# EAGLE schematic touch_glove (EAGLE 9.3.1)
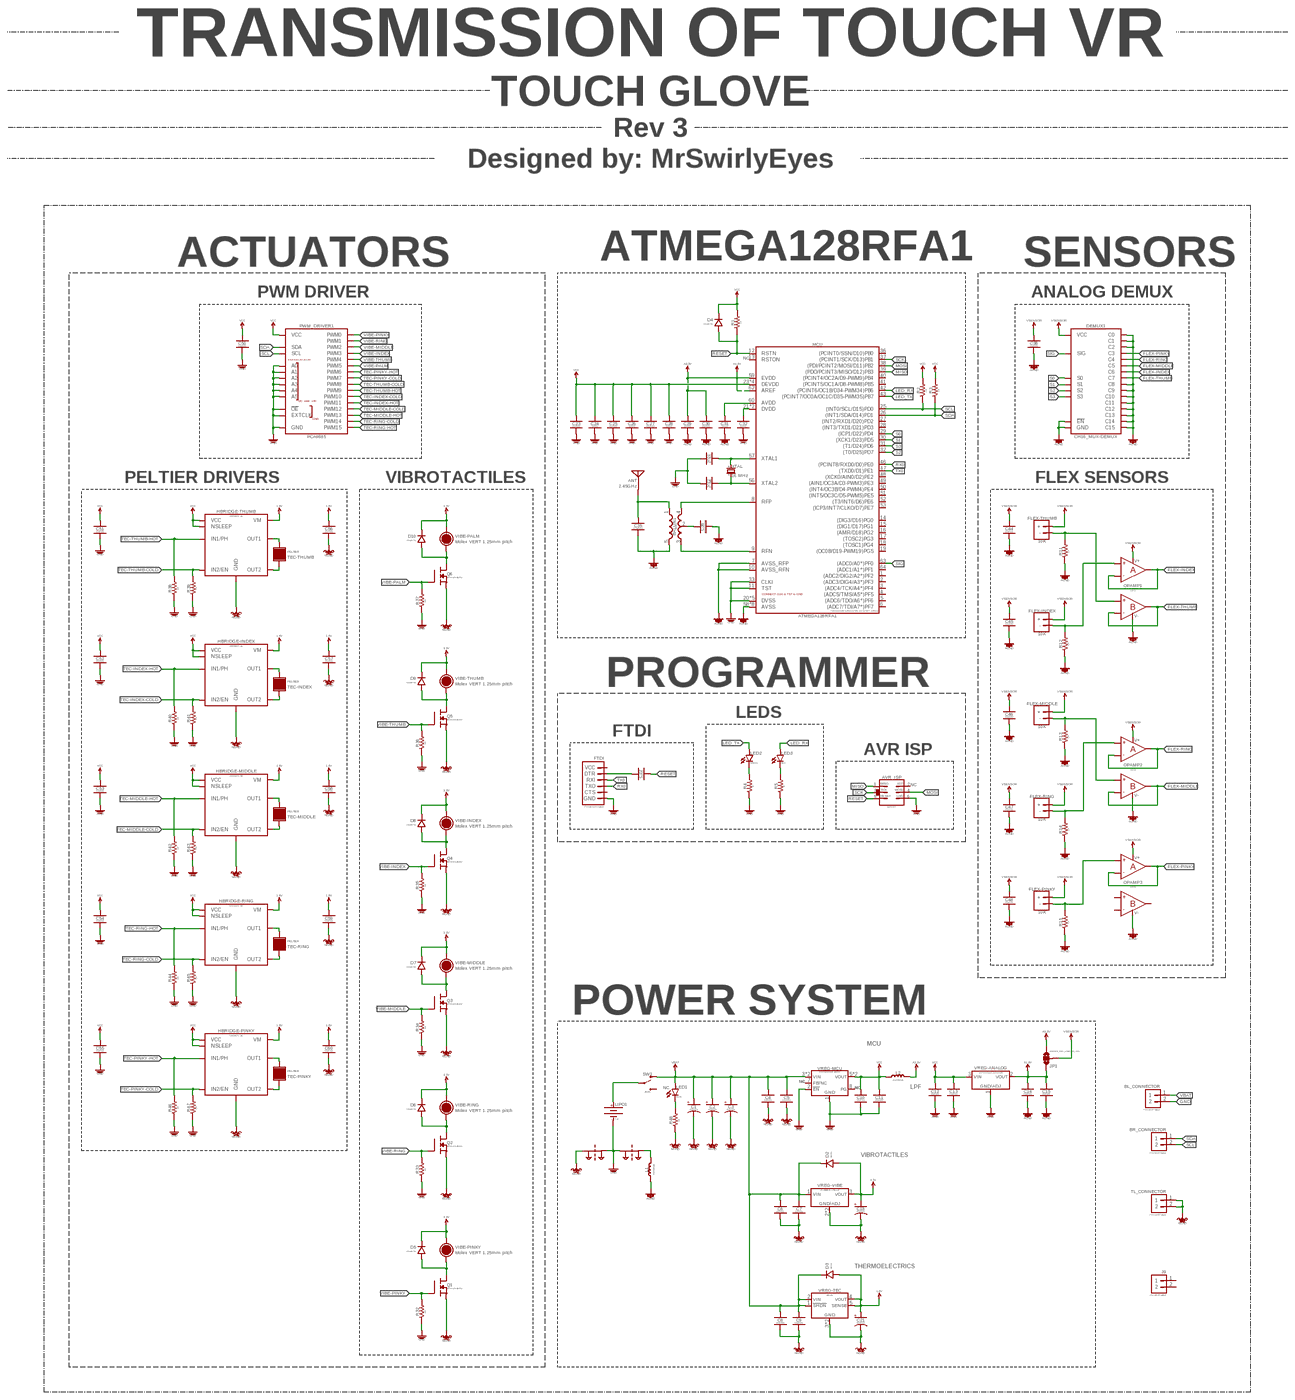
[diagram p0: schematic, sheet 1, overview]
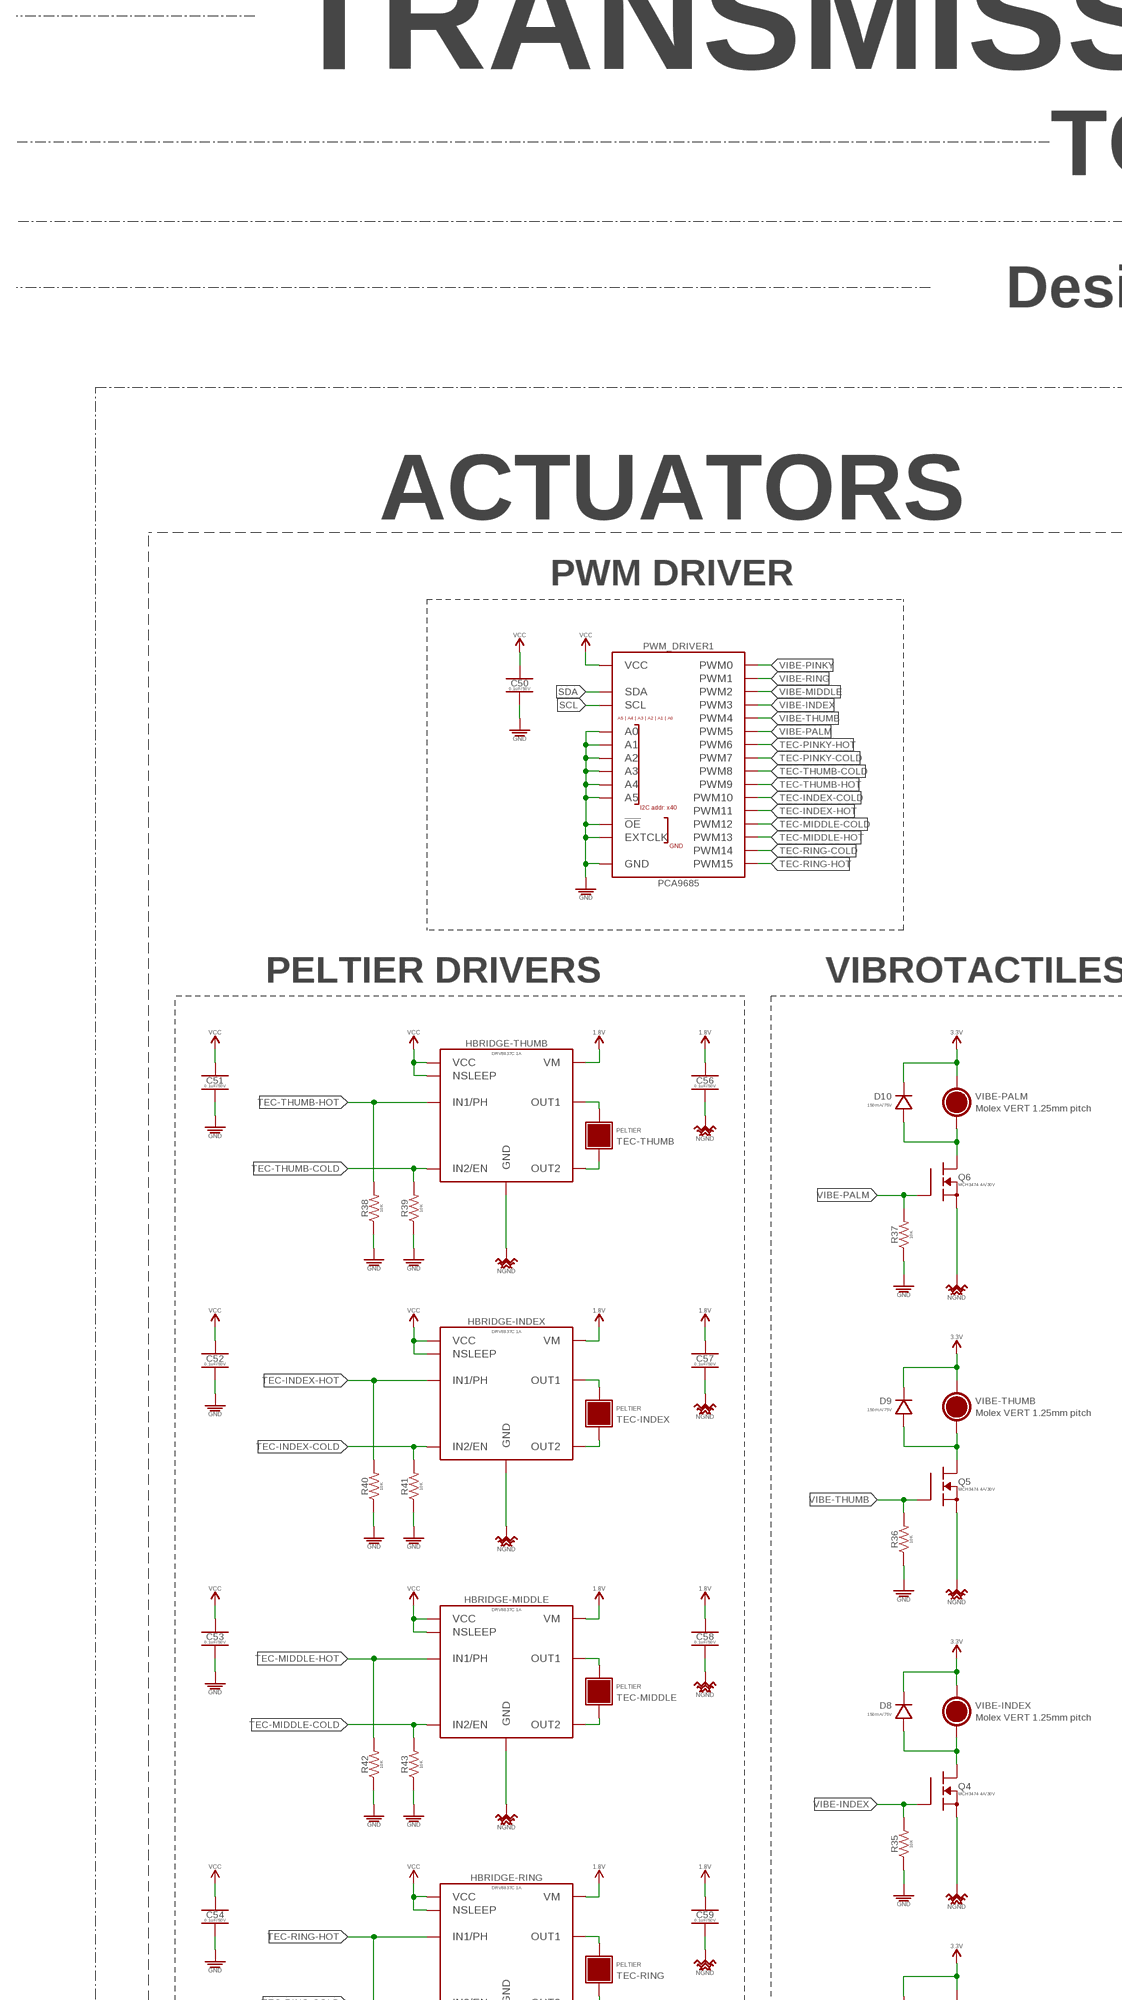
[diagram p1: schematic, sheet 1, part 1 of 4]
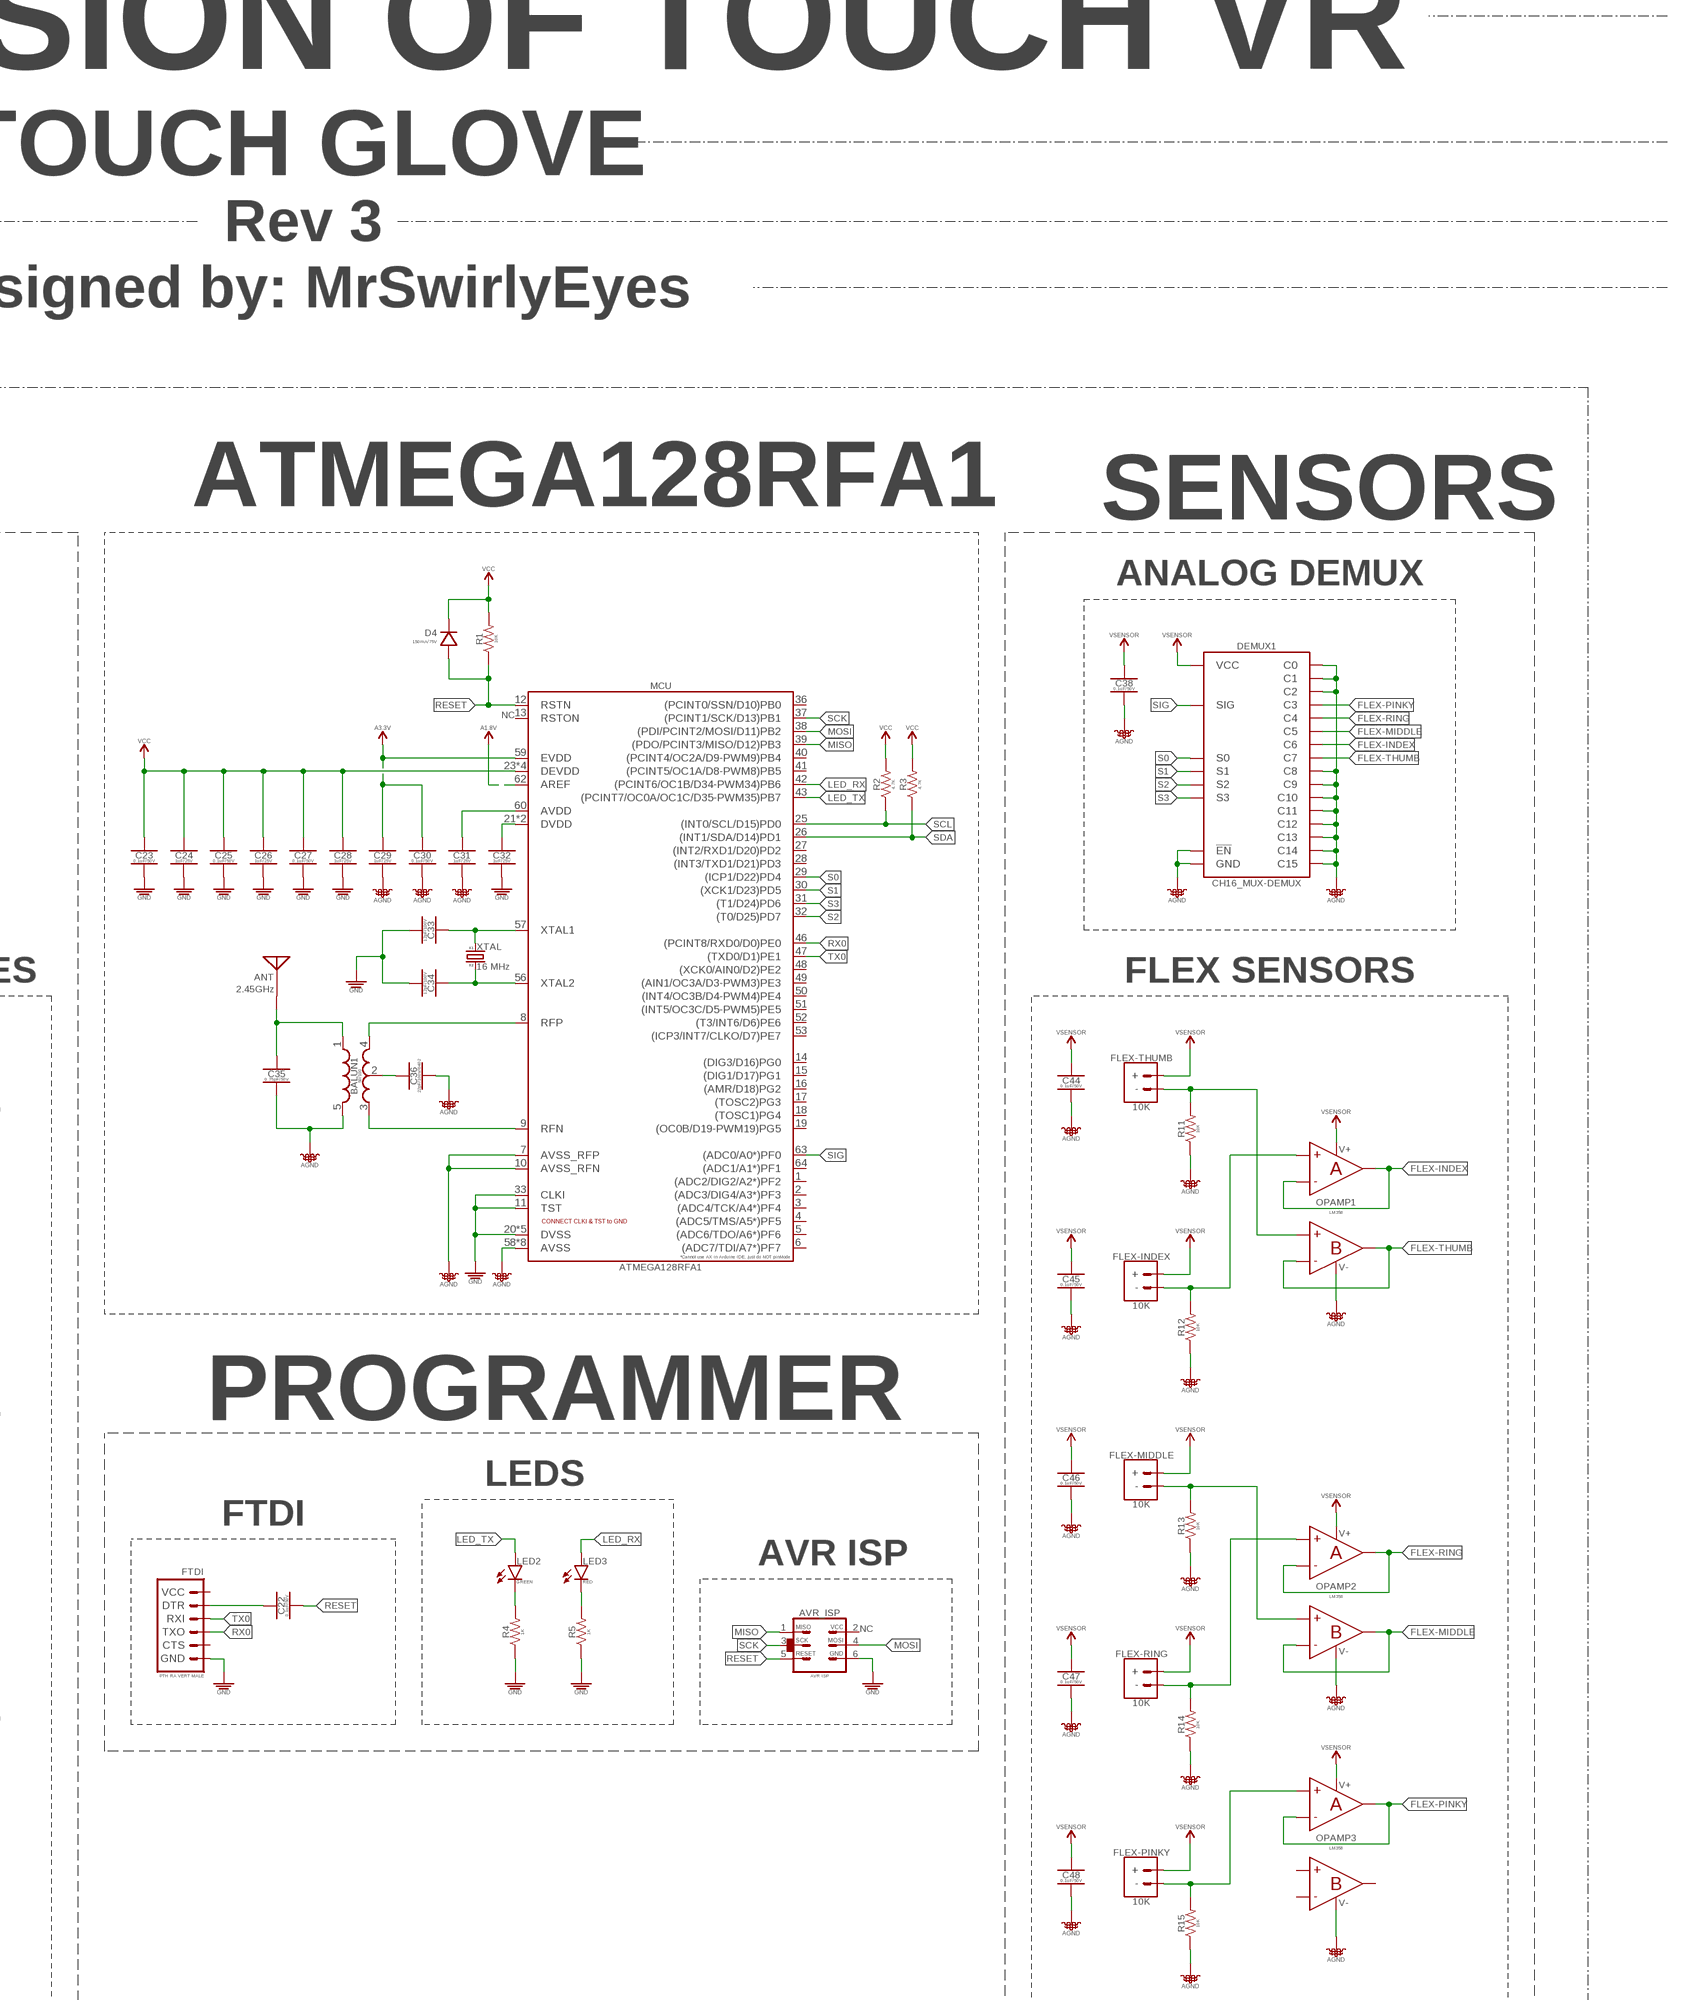
[diagram p2: schematic, sheet 1, part 2 of 4]
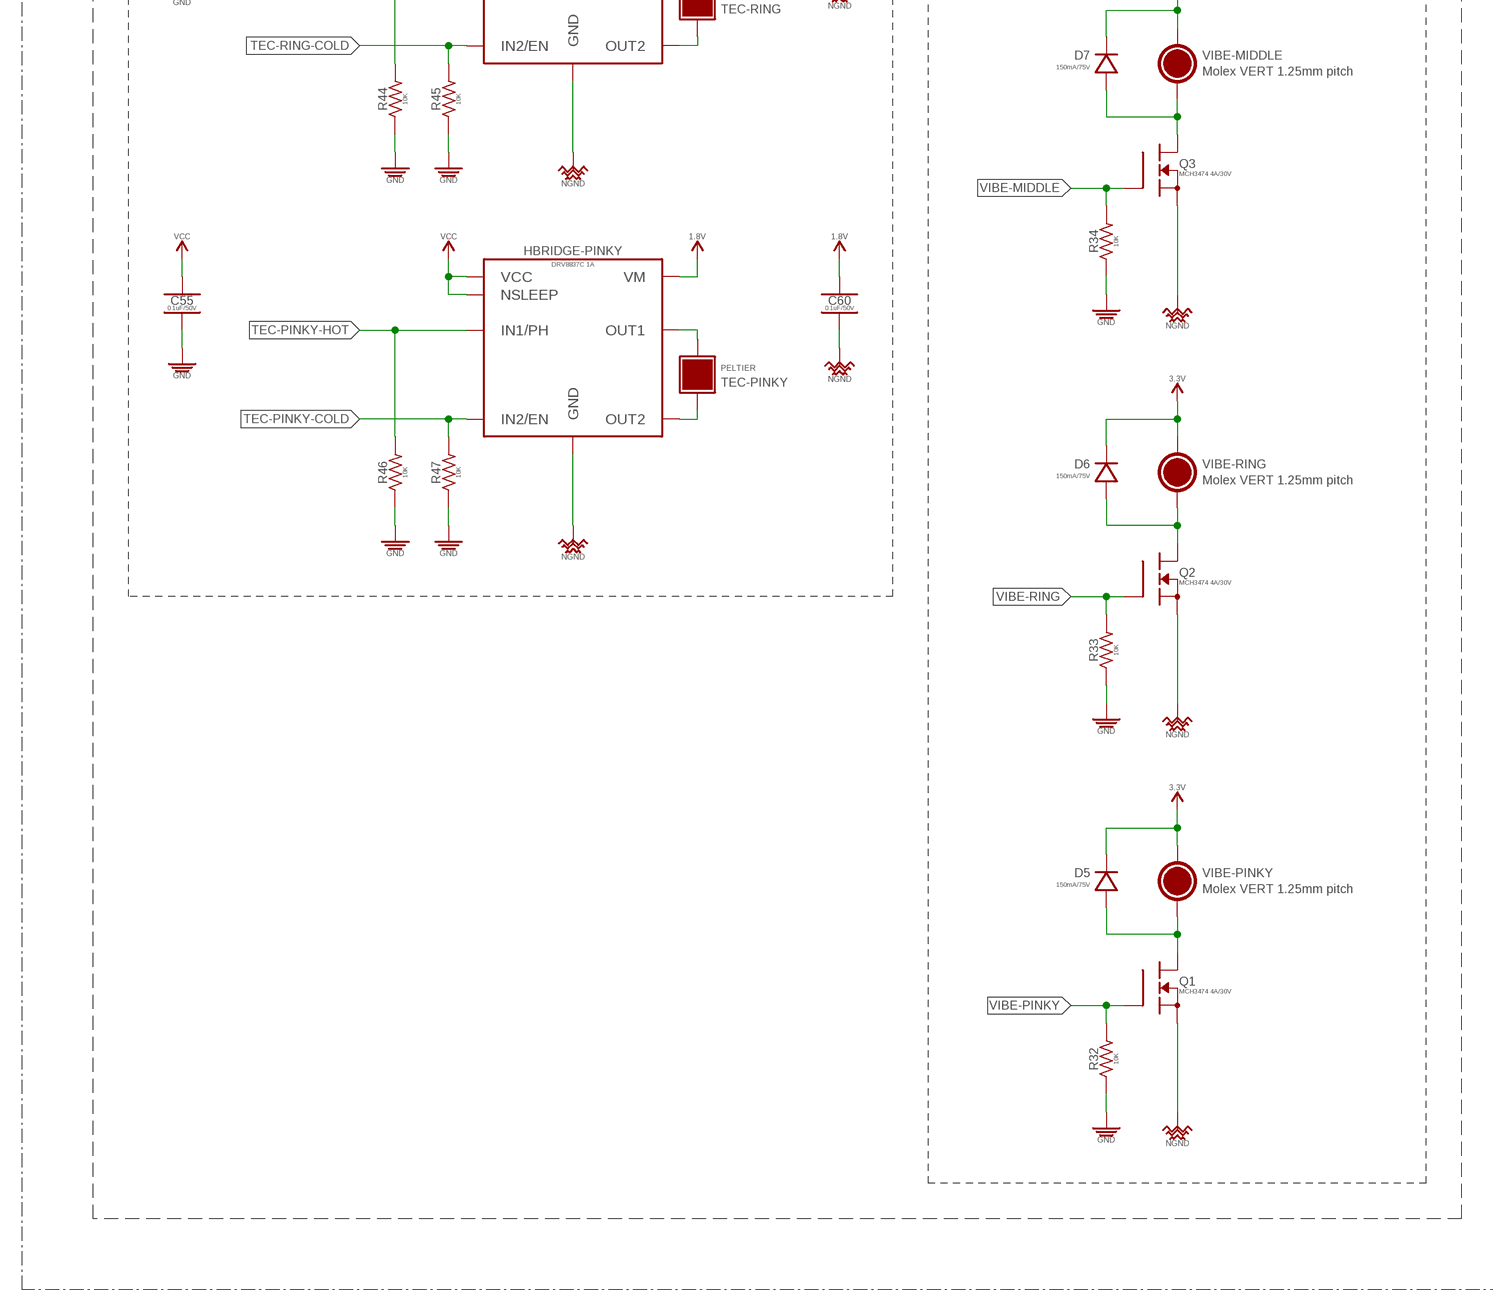
[diagram p3: schematic, sheet 1, part 3 of 4]
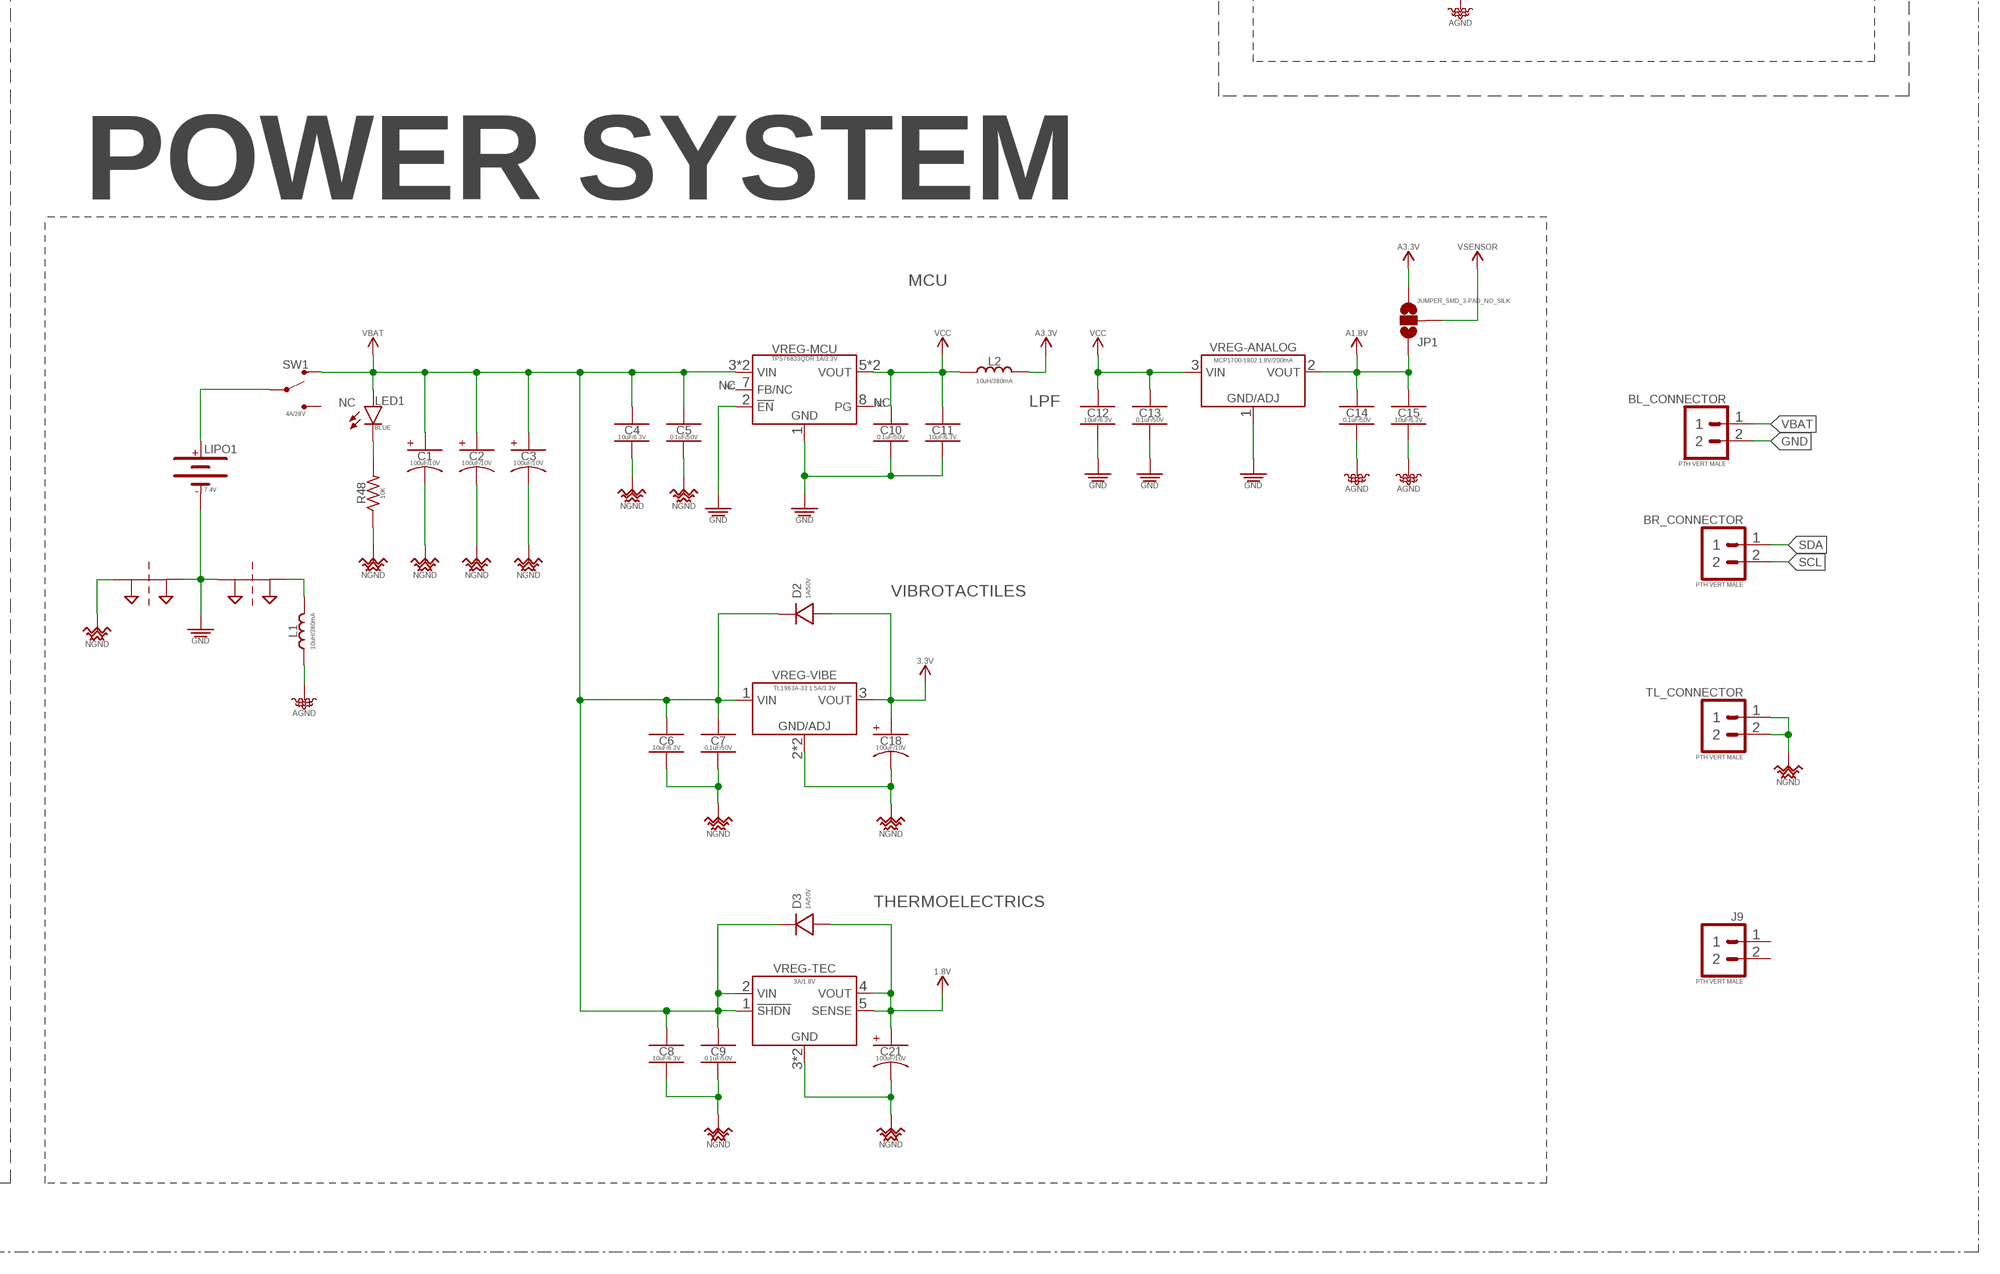
[diagram p4: schematic, sheet 1, part 4 of 4]

## Parts
ANT  2.45GHz  ANTENNA_SMD_CHP-2.45GHZ-0.5DBI-3W  [ANTC6522X100]
AVR_ISP  AVR ISP  AVR_SPI_PRG_6_PTH_VERT_MALE_2.54MM  [HDRV6W64P254_2X3_762X508X838B]
BALUN1  50/100  BALUN_SMD-0805_UNBAL/BAL-50/100  [RESCAXE65P200X125X95-6]
BL_CONNECTOR  PTH VERT MALE  1X02_PTH_VERT_MALE_2.54MM  [HDRV2W64P254_1X2_508X254X838B]
BR_ANALOG  NET_BRIDGE  [NET_BRIDGE]
BR_CONNECTOR  PTH VERT MALE  1X02_PTH_VERT_MALE_2.54MM  [HDRV2W64P254_1X2_508X254X838B]
BR_NOISE  NET_BRIDGE  [NET_BRIDGE]
C1  100uF/10V  100UF-POLARIZED_TANT_SMD-1206_10V-20%  [CAPCP3216X160]
C2  100uF/10V  100UF-POLARIZED_TANT_SMD-1206_10V-20%  [CAPCP3216X160]
C3  100uF/10V  100UF-POLARIZED_TANT_SMD-1206_10V-20%  [CAPCP3216X160]
C4  10uF/6.3V  10UF_CER_SMD-0402_6.3V-20%  [CAPC1005X55_SMD-0402]
C5  0.1uF/50V  0.1UF_SMD-0402_50V-10%  [CAPC1005X55_SMD-0402]
C6  10uF/6.3V  10UF_CER_SMD-0402_6.3V-20%  [CAPC1005X55_SMD-0402]
C7  0.1uF/50V  0.1UF_SMD-0402_50V-10%  [CAPC1005X55_SMD-0402]
C8  10uF/6.3V  10UF_CER_SMD-0402_6.3V-20%  [CAPC1005X55_SMD-0402]
C9  0.1uF/50V  0.1UF_SMD-0402_50V-10%  [CAPC1005X55_SMD-0402]
C10  0.1uF/50V  0.1UF_SMD-0402_50V-10%  [CAPC1005X55_SMD-0402]
C11  10uF/6.3V  10UF_CER_SMD-0402_6.3V-20%  [CAPC1005X55_SMD-0402]
C12  10uF/6.3V  10UF_CER_SMD-0402_6.3V-20%  [CAPC1005X55_SMD-0402]
C13  0.1uF/50V  0.1UF_SMD-0402_50V-10%  [CAPC1005X55_SMD-0402]
C14  0.1uF/50V  0.1UF_SMD-0402_50V-10%  [CAPC1005X55_SMD-0402]
C15  10uF/6.3V  10UF_CER_SMD-0402_6.3V-20%  [CAPC1005X55_SMD-0402]
C18  100uF/10V  100UF-POLARIZED_TANT_SMD-1206_10V-20%  [CAPCP3216X160]
C21  100uF/10V  100UF-POLARIZED_TANT_SMD-1206_10V-20%  [CAPCP3216X160]
C22  0.1uF/50V  0.1UF_SMD-0402_50V-10%  [CAPC1005X55_SMD-0402]
C23  0.1uF/50V  0.1UF_SMD-0402_50V-10%  [CAPC1005X55_SMD-0402]
C24  1uF/25V  1UF_CER_SMD-0402_25V-10%  [CAPC1005X55_SMD-0402]
C25  0.1uF/50V  0.1UF_SMD-0402_50V-10%  [CAPC1005X55_SMD-0402]
C26  1uF/25V  1UF_CER_SMD-0402_25V-10%  [CAPC1005X55_SMD-0402]
C27  0.1uF/50V  0.1UF_SMD-0402_50V-10%  [CAPC1005X55_SMD-0402]
C28  1uF/25V  1UF_CER_SMD-0402_25V-10%  [CAPC1005X55_SMD-0402]
C29  1uF/25V  1UF_CER_SMD-0402_25V-10%  [CAPC1005X55_SMD-0402]
C30  0.1uF/50V  0.1UF_SMD-0402_50V-10%  [CAPC1005X55_SMD-0402]
C31  1uF/25V  1UF_CER_SMD-0402_25V-10%  [CAPC1005X55_SMD-0402]
C32  1uF/25V  1UF_CER_SMD-0402_25V-10%  [CAPC1005X55_SMD-0402]
C33  12pF/100V  12PF_SMD-0402_100V-5%  [CAPC1005X55_SMD-0402]
C34  12pF/100V  12PF_SMD-0402_100V-5%  [CAPC1005X55_SMD-0402]
C35  0.75pF/50V  0.75PF_CER_SMD-0402_50V-33%  [CAPC1005X55_SMD-0402]
C36  22pF/100V/0402  22PF_CER_SMD-0402-100V-5%  [CAPC1005X55_SMD-0402]
C38  0.1uF/50V  0.1UF_SMD-0402_50V-10%  [CAPC1005X55_SMD-0402]
C44  0.1uF/50V  0.1UF_SMD-0402_50V-10%  [CAPC1005X55_SMD-0402]
C45  0.1uF/50V  0.1UF_SMD-0402_50V-10%  [CAPC1005X55_SMD-0402]
C46  0.1uF/50V  0.1UF_SMD-0402_50V-10%  [CAPC1005X55_SMD-0402]
C47  0.1uF/50V  0.1UF_SMD-0402_50V-10%  [CAPC1005X55_SMD-0402]
C48  0.1uF/50V  0.1UF_SMD-0402_50V-10%  [CAPC1005X55_SMD-0402]
C50  0.1uF/50V  0.1UF_SMD-0402_50V-10%  [CAPC1005X55_SMD-0402]
C51  0.1uF/50V  0.1UF_SMD-0402_50V-10%  [CAPC1005X55_SMD-0402]
C52  0.1uF/50V  0.1UF_SMD-0402_50V-10%  [CAPC1005X55_SMD-0402]
C53  0.1uF/50V  0.1UF_SMD-0402_50V-10%  [CAPC1005X55_SMD-0402]
C54  0.1uF/50V  0.1UF_SMD-0402_50V-10%  [CAPC1005X55_SMD-0402]
C55  0.1uF/50V  0.1UF_SMD-0402_50V-10%  [CAPC1005X55_SMD-0402]
C56  0.1uF/50V  0.1UF_SMD-0402_50V-10%  [CAPC1005X55_SMD-0402]
C57  0.1uF/50V  0.1UF_SMD-0402_50V-10%  [CAPC1005X55_SMD-0402]
C58  0.1uF/50V  0.1UF_SMD-0402_50V-10%  [CAPC1005X55_SMD-0402]
C59  0.1uF/50V  0.1UF_SMD-0402_50V-10%  [CAPC1005X55_SMD-0402]
C60  0.1uF/50V  0.1UF_SMD-0402_50V-10%  [CAPC1005X55_SMD-0402]
D2  1A/50V  GENERAL-PURPOSE_SMD_GP_1A-50V  [SODFL3516X170]
D3  1A/50V  GENERAL-PURPOSE_SMD_GP_1A-50V  [SODFL3516X170]
D4  150mA/75V  GENERAL-PURPOSE_SMD-0402_GP_150MA-75V  [DFN100X60X55-2]
D5  150mA/75V  GENERAL-PURPOSE_SMD-0402_GP_150MA-75V  [DFN100X60X55-2]
D6  150mA/75V  GENERAL-PURPOSE_SMD-0402_GP_150MA-75V  [DFN100X60X55-2]
D7  150mA/75V  GENERAL-PURPOSE_SMD-0402_GP_150MA-75V  [DFN100X60X55-2]
D8  150mA/75V  GENERAL-PURPOSE_SMD-0402_GP_150MA-75V  [DFN100X60X55-2]
D9  150mA/75V  GENERAL-PURPOSE_SMD-0402_GP_150MA-75V  [DFN100X60X55-2]
D10  150mA/75V  GENERAL-PURPOSE_SMD-0402_GP_150MA-75V  [DFN100X60X55-2]
DEMUX1  CH16_MUX-DEMUX  CD74HC4067-SM96_16:1_MUX-DEMUX_SOP-24_16:1-MUX-DEMUX  [SOP65P780X200-24]
FLEX-INDEX  10K  FLEX_SENSOR_0530470210_VERT-MALE_PITCH-1.25MM  [_MOLEX-0530470210_VERT_PITCH-1.25MM]
FLEX-MIDDLE  10K  FLEX_SENSOR_0530470210_VERT-MALE_PITCH-1.25MM  [_MOLEX-0530470210_VERT_PITCH-1.25MM]
FLEX-PINKY  10K  FLEX_SENSOR_0530470210_VERT-MALE_PITCH-1.25MM  [_MOLEX-0530470210_VERT_PITCH-1.25MM]
FLEX-RING  10K  FLEX_SENSOR_0530470210_VERT-MALE_PITCH-1.25MM  [_MOLEX-0530470210_VERT_PITCH-1.25MM]
FLEX-THUMB  10K  FLEX_SENSOR_0530470210_VERT-MALE_PITCH-1.25MM  [_MOLEX-0530470210_VERT_PITCH-1.25MM]
FTDI  PTH RA VERT MALE  FTDI_PTH_RA_MALE_2.54MM  [HDRRA6W64P254_1X6_1524X254X254B_FTDI]
HBRIDGE-INDEX  DRV8837C 1A  DRV883X_H-BRIDGE_DRV8837C_1A  [WSON-8-PPAD]
HBRIDGE-MIDDLE  DRV8837C 1A  DRV883X_H-BRIDGE_DRV8837C_1A  [WSON-8-PPAD]
HBRIDGE-PINKY  DRV8837C 1A  DRV883X_H-BRIDGE_DRV8837C_1A  [WSON-8-PPAD]
HBRIDGE-RING  DRV8837C 1A  DRV883X_H-BRIDGE_DRV8837C_1A  [WSON-8-PPAD]
HBRIDGE-THUMB  DRV8837C 1A  DRV883X_H-BRIDGE_DRV8837C_1A  [WSON-8-PPAD]
J9  PTH VERT MALE  1X02_PTH_VERT_MALE_2.54MM  [HDRV2W64P254_1X2_508X254X838B]
JP1  JUMPER_SMD_3-PAD_NO_SILK  [SMT-JUMPER_3_NO_SILK]
L1  10uH/380mA  10UH_SMD-0603_0.38A-0.468OHM-10%  [INDC1608X60-0603]
L2  10uH/380mA  10UH_SMD-0603_0.38A-0.468OHM-10%  [INDC1608X60-0603]
LED1  BLUE  LED_SMD-0402_DISCRETE_BLUE  [LEDC1005X40_LED-0402]
LED2  GREEN  LED_SMD-0402_DISCRETE_GREEN  [LEDC1005X40_LED-0402]
LED3  RED  LED_SMD-0402_DISCRETE_RED  [LEDC1005X40_LED-0402]
LIPO1  7.4V  BATTERY-CONNECTOR_MOLEX_0530470210_VERT-MALE_PITCH-1.25MM  [BATTERY_MOLEX-0530470210_VERT_PITCH-1.25MM]
MCU  ATMEGA128RFA1  ATMEGA128RFA1_VFQFN-64_EXPOSED-PAD  [QFN50P900X900X90-64]
OPAMP1  LM358  LM358_DFN-EP  [WSON-8-PPAD]
OPAMP2  LM358  LM358_DFN-EP  [WSON-8-PPAD]
OPAMP3  LM358  LM358_DFN-EP  [WSON-8-PPAD]
PWM_DRIVER1  PCA9685  PCA9685_16-CH_12-BIT_PWM-DRIVER_TSSOP-28_PWM-DRIVER_16CH  [SOP65P650X110-28]
Q1  MCH3474 4A/30V  POWER_NCHAN_MCH3474_NMOS_4A-30V  [SOTFL65P209X90-3]
Q2  MCH3474 4A/30V  POWER_NCHAN_MCH3474_NMOS_4A-30V  [SOTFL65P209X90-3]
Q3  MCH3474 4A/30V  POWER_NCHAN_MCH3474_NMOS_4A-30V  [SOTFL65P209X90-3]
Q4  MCH3474 4A/30V  POWER_NCHAN_MCH3474_NMOS_4A-30V  [SOTFL65P209X90-3]
Q5  MCH3474 4A/30V  POWER_NCHAN_MCH3474_NMOS_4A-30V  [SOTFL65P209X90-3]
Q6  MCH3474 4A/30V  POWER_NCHAN_MCH3474_NMOS_4A-30V  [SOTFL65P209X90-3]
R1  10K  10KΩ_SMD-0402_1/16W-5%  [RESC1005X35_SMD-0402]
R2  4.7K  4.7KΩ_SMD-0402_1/16W-5%  [RESC1005X35_SMD-0402]
R3  4.7K  4.7KΩ_SMD-0402_1/16W-5%  [RESC1005X35_SMD-0402]
R4  1K  1KΩ_SMD-0402_1/16W-5%  [RESC1005X35_SMD-0402]
R5  1K  1KΩ_SMD-0402_1/16W-5%  [RESC1005X35_SMD-0402]
R11  10K  10KΩ_SMD-0402_1/16W-5%  [RESC1005X35_SMD-0402]
R12  10K  10KΩ_SMD-0402_1/16W-5%  [RESC1005X35_SMD-0402]
R13  10K  10KΩ_SMD-0402_1/16W-5%  [RESC1005X35_SMD-0402]
R14  10K  10KΩ_SMD-0402_1/16W-5%  [RESC1005X35_SMD-0402]
R15  10K  10KΩ_SMD-0402_1/16W-5%  [RESC1005X35_SMD-0402]
R32  10K  10KΩ_SMD-0402_1/16W-5%  [RESC1005X35_SMD-0402]
R33  10K  10KΩ_SMD-0402_1/16W-5%  [RESC1005X35_SMD-0402]
R34  10K  10KΩ_SMD-0402_1/16W-5%  [RESC1005X35_SMD-0402]
R35  10K  10KΩ_SMD-0402_1/16W-5%  [RESC1005X35_SMD-0402]
R36  10K  10KΩ_SMD-0402_1/16W-5%  [RESC1005X35_SMD-0402]
R37  10K  10KΩ_SMD-0402_1/16W-5%  [RESC1005X35_SMD-0402]
R38  10K  10KΩ_SMD-0402_1/16W-5%  [RESC1005X35_SMD-0402]
R39  10K  10KΩ_SMD-0402_1/16W-5%  [RESC1005X35_SMD-0402]
R40  10K  10KΩ_SMD-0402_1/16W-5%  [RESC1005X35_SMD-0402]
R41  10K  10KΩ_SMD-0402_1/16W-5%  [RESC1005X35_SMD-0402]
R42  10K  10KΩ_SMD-0402_1/16W-5%  [RESC1005X35_SMD-0402]
R43  10K  10KΩ_SMD-0402_1/16W-5%  [RESC1005X35_SMD-0402]
R44  10K  10KΩ_SMD-0402_1/16W-5%  [RESC1005X35_SMD-0402]
R45  10K  10KΩ_SMD-0402_1/16W-5%  [RESC1005X35_SMD-0402]
R46  10K  10KΩ_SMD-0402_1/16W-5%  [RESC1005X35_SMD-0402]
R47  10K  10KΩ_SMD-0402_1/16W-5%  [RESC1005X35_SMD-0402]
R48  10K  10KΩ_SMD-0402_1/16W-5%  [RESC1005X35_SMD-0402]
SW1  4A/28V  SWITCH_SPDT_RA_PTH_4A-28V_L12.7-W9.5  [SW_SLIDE_SPDT_RA_PTH_12.7L-9.5W]
TEC-INDEX  PELTIER  PELTIER-TEC_CONNECTOR_0530470210_VERT-MALE_PITCH-1.25MM  [_MOLEX-0530470210_VERT_PITCH-1.25MM]
TEC-MIDDLE  PELTIER  PELTIER-TEC_CONNECTOR_0530470210_VERT-MALE_PITCH-1.25MM  [_MOLEX-0530470210_VERT_PITCH-1.25MM]
TEC-PINKY  PELTIER  PELTIER-TEC_CONNECTOR_0530470210_VERT-MALE_PITCH-1.25MM  [_MOLEX-0530470210_VERT_PITCH-1.25MM]
TEC-RING  PELTIER  PELTIER-TEC_CONNECTOR_0530470210_VERT-MALE_PITCH-1.25MM  [_MOLEX-0530470210_VERT_PITCH-1.25MM]
TEC-THUMB  PELTIER  PELTIER-TEC_CONNECTOR_0530470210_VERT-MALE_PITCH-1.25MM  [_MOLEX-0530470210_VERT_PITCH-1.25MM]
TL_CONNECTOR  PTH VERT MALE  1X02_PTH_VERT_MALE_2.54MM  [HDRV2W64P254_1X2_508X254X838B]
VIBE-INDEX  Molex VERT 1.25mm pitch  VIBE-MOTOR_CONNECTOR_0530470210_VERT-MALE_PITCH-1.25MM  [_MOLEX-0530470210_VERT_PITCH-1.25MM]
VIBE-MIDDLE  Molex VERT 1.25mm pitch  VIBE-MOTOR_CONNECTOR_0530470210_VERT-MALE_PITCH-1.25MM  [_MOLEX-0530470210_VERT_PITCH-1.25MM]
VIBE-PALM  Molex VERT 1.25mm pitch  VIBE-MOTOR_CONNECTOR_0530470210_VERT-MALE_PITCH-1.25MM  [_MOLEX-0530470210_VERT_PITCH-1.25MM]
VIBE-PINKY  Molex VERT 1.25mm pitch  VIBE-MOTOR_CONNECTOR_0530470210_VERT-MALE_PITCH-1.25MM  [_MOLEX-0530470210_VERT_PITCH-1.25MM]
VIBE-RING  Molex VERT 1.25mm pitch  VIBE-MOTOR_CONNECTOR_0530470210_VERT-MALE_PITCH-1.25MM  [_MOLEX-0530470210_VERT_PITCH-1.25MM]
VIBE-THUMB  Molex VERT 1.25mm pitch  VIBE-MOTOR_CONNECTOR_0530470210_VERT-MALE_PITCH-1.25MM  [_MOLEX-0530470210_VERT_PITCH-1.25MM]
VREG-ANALOG  MCP1700-1802 1.8V/200mA  VREG_LINEAR_MCP1700_MCP1700T-1802_1.8V-200MA_SOT-23  [SOT95P237X112-3_SOT-23-3]
VREG-MCU  TPS76833QDR 1A/3.3V  VREG_TPS768XX_ULDO_FAST-TRANSIENT_TPS76833QDR_1A-3.3V  [SOIC127P600X265-8]
VREG-TEC  3A/1.8V  VREG_LT1764EQ_ULDO_FAST-TRANSIENT_LT1764EQ-1.8_3A_1.8V  [TO170P1363X457-6]
VREG-VIBE  TL1963A-33 1.5A/3.3V  VREG_TL1963A-XX_1.5A_LN_LDO_FAST-TRANSIENT_SOT-223-4_TL1963A-33_1.5A-3.3V  [SOT229P700X180-4]
XTAL  16 MHz  CRYSTAL_ABM3B_16MHZ_18PF  [OSCCC500X320X110_CRYSTAL]

## Nets
1.8V: C21.A C56.1 C57.1 C58.1 C59.1 C60.1 D3.A HBRIDGE-INDEX.1(VM) HBRIDGE-MIDDLE.1(VM) HBRIDGE-PINKY.1(VM) HBRIDGE-RING.1(VM) HBRIDGE-THUMB.1(VM) VREG-TEC.4(VOUT) VREG-TEC.5(SENSE)
3.3V: C18.A D2.A D5.K D6.K D7.K D8.K D9.K D10.K VIBE-INDEX.1(+) VIBE-MIDDLE.1(+) VIBE-PALM.1(+) VIBE-PINKY.1(+) VIBE-RING.1(+) VIBE-THUMB.1(+) VREG-VIBE.3(VO)
+: LIPO1.+ SW1.P
A1.8V: C14.1 C15.1 JP1.1 MCU.62(AREF) VREG-ANALOG.2(VO)
A3.3V [ASIG]: C29.1 C30.1 JP1.3 L2.2 MCU.59(EVDD)
AGND [ASIG]: BALUN1.5(GND) C14.2 C15.2 C29.2 C30.2 C31.2 C35.2 C36.2 C38.2 C44.2 C45.2 C46.2 C47.2 C48.2 DEMUX1.7(C2) DEMUX1.8(C1) DEMUX1.9(C0) DEMUX1.12(GND) DEMUX1.15(!EN) DEMUX1.16(C15) DEMUX1.17(C14) DEMUX1.18(C13) DEMUX1.19(C12) DEMUX1.20(C11) DEMUX1.21(C10) DEMUX1.22(C9) DEMUX1.23(C8) L1.2 MCU.7(AVSS_RFP) MCU.10(AVSS_RFN) MCU.58(AVSS) MCU.61(AVSS) MCU.EP(AVSS) MCU.P$1(AVSS) MCU.P$2(AVSS) MCU.P$3(AVSS) MCU.P$4(AVSS) MCU.P$5(AVSS) OPAMP1.4(V-) OPAMP1.GND(V-) OPAMP1.P$1(V-) OPAMP1.P$2(V-) OPAMP2.4(V-) OPAMP2.GND(V-) OPAMP2.P$1(V-) OPAMP2.P$2(V-) OPAMP3.4(V-) OPAMP3.GND(V-) OPAMP3.P$1(V-) OPAMP3.P$2(V-) R11.1 R12.1 R13.1 R14.1 R15.1
FLEX-INDEX: DEMUX1.3(C6) OPAMP1.1(OUT-A) OPAMP1.2(IN-A-)
FLEX-MIDDLE: DEMUX1.4(C5) OPAMP2.6(IN-B-) OPAMP2.7(OUT-B)
FLEX-PINKY: DEMUX1.6(C3) OPAMP3.1(OUT-A) OPAMP3.2(IN-A-)
FLEX-RING: DEMUX1.5(C4) OPAMP2.1(OUT-A) OPAMP2.2(IN-A-)
FLEX-THUMB: DEMUX1.2(C7) OPAMP1.6(IN-B-) OPAMP1.7(OUT-B)
GND [DGND]: AVR_ISP.GND BL_CONNECTOR.2 BR_ANALOG.P$1 BR_NOISE.P$2 C10.2 C11.2 C12.2 C13.2 C23.2 C24.2 C25.2 C26.2 C27.2 C28.2 C32.2 C33.2 C34.2 C50.2 C51.2 C52.2 C53.2 C54.2 C55.2 FTDI.GND LIPO1.- MCU.11(TST) MCU.20(DVSS) MCU.24(DVSS) MCU.33(CLKI) MCU.35(DVSS) MCU.45(DVSS) MCU.55(DVSS) PWM_DRIVER1.1(A0) PWM_DRIVER1.2(A1) PWM_DRIVER1.3(A2) PWM_DRIVER1.4(A3) PWM_DRIVER1.5(A4) PWM_DRIVER1.14(GND) PWM_DRIVER1.23(!OE) PWM_DRIVER1.24(A5) PWM_DRIVER1.25(EXTCLK) R4.1 R5.1 R32.1 R33.1 R34.1 R35.1 R36.1 R37.1 R38.1 R39.1 R40.1 R41.1 R42.1 R43.1 R44.1 R45.1 R46.1 R47.1 VREG-ANALOG.1(GND) VREG-MCU.1(GND) VREG-MCU.2(!EN)
LED_RX: LED3.A MCU.42((PCINT6/OC1B/D34-PWM34)PB6)
LED_TX: LED2.A MCU.43((PCINT7/OC0A/OC1C/D35-PWM35)PB7)
MISO: AVR_ISP.MISO MCU.39((PDO/PCINT3/MISO/D12)PB3)
MOSI: AVR_ISP.MOSI MCU.38((PDI/PCINT2/MOSI/D11)PB2)
N$1: HBRIDGE-THUMB.3(OUT2) TEC-THUMB.1(HOT)
N$2: D8.A Q4.3(D) VIBE-INDEX.2(-)
N$3: D9.A Q5.3(D) VIBE-THUMB.2(-)
N$4: D7.A Q3.3(D) VIBE-MIDDLE.2(-)
N$5: HBRIDGE-THUMB.2(OUT1) TEC-THUMB.2(COLD)
N$6: HBRIDGE-INDEX.2(OUT1) TEC-INDEX.2(COLD)
N$11: HBRIDGE-INDEX.3(OUT2) TEC-INDEX.1(HOT)
N$12: HBRIDGE-MIDDLE.3(OUT2) TEC-MIDDLE.1(HOT)
N$15: D6.A Q2.3(D) VIBE-RING.2(-)
N$16: HBRIDGE-MIDDLE.2(OUT1) TEC-MIDDLE.2(COLD)
N$17: D5.A Q1.3(D) VIBE-PINKY.2(-)
N$18: HBRIDGE-RING.3(OUT2) TEC-RING.1(HOT)
N$23: HBRIDGE-RING.2(OUT1) TEC-RING.2(COLD)
N$24: HBRIDGE-PINKY.3(OUT2) TEC-PINKY.1(HOT)
N$27: HBRIDGE-PINKY.2(OUT1) TEC-PINKY.2(COLD)
N$30: D10.A Q6.3(D) VIBE-PALM.2(-)
N$35: C34.1 MCU.56(XTAL2) XTAL.3(XTAL2)
N$36: C33.1 MCU.57(XTAL1) XTAL.1(XTAL1)
N$38: FLEX-INDEX.2(-) OPAMP1.3(IN-A+) R12.2
N$40: BR_ANALOG.P$2 L1.1
N$41: FLEX-RING.2(-) OPAMP2.3(IN-A+) R14.2
N$45 [ASIG]: BALUN1.3(OUT1) MCU.9(RFN)
N$46 [ASIG]: BALUN1.4(OUT2) MCU.8(RFP)
N$47 [ASIG]: BALUN1.2(GND) C36.1
N$50: C22.1 FTDI.DTR
N$53: LED1.K R48.2
N$54: LED2.K R4.2
N$55: LED3.K R5.2
N$62: C32.1 MCU.21(DVDD) MCU.22(DVDD)
N$63: C31.1 MCU.60(AVDD)
N$991: FLEX-MIDDLE.2(-) OPAMP2.5(IN-B+) R13.2
N$1004: FLEX-THUMB.2(-) OPAMP1.5(IN-B+) R11.2
N$10001: FLEX-PINKY.2(-) OPAMP3.3(IN-A+) R15.2
NGND [NGND]: BR_NOISE.P$1 C1.K C2.K C3.K C4.2 C5.2 C6.2 C7.2 C8.2 C9.2 C18.K C21.K C56.2 C57.2 C58.2 C59.2 C60.2 HBRIDGE-INDEX.4(GND) HBRIDGE-INDEX.GND HBRIDGE-INDEX.P$1(GND) HBRIDGE-INDEX.P$2(GND) HBRIDGE-MIDDLE.4(GND) HBRIDGE-MIDDLE.GND HBRIDGE-MIDDLE.P$1(GND) HBRIDGE-MIDDLE.P$2(GND) HBRIDGE-PINKY.4(GND) HBRIDGE-PINKY.GND HBRIDGE-PINKY.P$1(GND) HBRIDGE-PINKY.P$2(GND) HBRIDGE-RING.4(GND) HBRIDGE-RING.GND HBRIDGE-RING.P$1(GND) HBRIDGE-RING.P$2(GND) HBRIDGE-THUMB.4(GND) HBRIDGE-THUMB.GND HBRIDGE-THUMB.P$1(GND) HBRIDGE-THUMB.P$2(GND) Q1.2(S) Q2.2(S) Q3.2(S) Q4.2(S) Q5.2(S) Q6.2(S) R48.1 TL_CONNECTOR.1 TL_CONNECTOR.2 VREG-TEC.3(GND) VREG-TEC.TAB(GND) VREG-VIBE.2(GND) VREG-VIBE.TAB(GND)
RESET: AVR_ISP.RESET C22.2 D4.A MCU.12(RSTN) R1.1
RFSIG [RFSIG]: ANT.1(SIGNAL) BALUN1.1(IN) C35.1
RX0: FTDI.TXO MCU.46((PCINT8/RXD0/D0)PE0)
S0: DEMUX1.10(S0) MCU.29((ICP1/D22)PD4)
S1: DEMUX1.11(S1) MCU.30((XCK1/D23)PD5)
S2: DEMUX1.14(S2) MCU.32((T0/D25)PD7)
S3: DEMUX1.13(S3) MCU.31((T1/D24)PD6)
SCK: AVR_ISP.SCK MCU.37((PCINT1/SCK/D13)PB1)
SCL: BR_CONNECTOR.2 MCU.25((INT0/SCL/D15)PD0) PWM_DRIVER1.26(SCL) R2.1
SDA: BR_CONNECTOR.1 MCU.26((INT1/SDA/D14)PD1) PWM_DRIVER1.27(SDA) R3.1
SIG [ASIG]: DEMUX1.1(SIG) MCU.63((ADC0/A0*)PF0)
TEC-INDEX-COLD: HBRIDGE-INDEX.5(IN2/EN) PWM_DRIVER1.17(PWM10) R41.2
TEC-INDEX-HOT: HBRIDGE-INDEX.6(IN1/PH) PWM_DRIVER1.18(PWM11) R40.2
TEC-MIDDLE-COLD: HBRIDGE-MIDDLE.5(IN2/EN) PWM_DRIVER1.19(PWM12) R43.2
TEC-MIDDLE-HOT: HBRIDGE-MIDDLE.6(IN1/PH) PWM_DRIVER1.20(PWM13) R42.2
TEC-PINKY-COLD: HBRIDGE-PINKY.5(IN2/EN) PWM_DRIVER1.13(PWM7) R47.2
TEC-PINKY-HOT: HBRIDGE-PINKY.6(IN1/PH) PWM_DRIVER1.12(PWM6) R46.2
TEC-RING-COLD: HBRIDGE-RING.5(IN2/EN) PWM_DRIVER1.21(PWM14) R45.2
TEC-RING-HOT: HBRIDGE-RING.6(IN1/PH) PWM_DRIVER1.22(PWM15) R44.2
TEC-THUMB-COLD: HBRIDGE-THUMB.5(IN2/EN) PWM_DRIVER1.15(PWM8) R39.2
TEC-THUMB-HOT: HBRIDGE-THUMB.6(IN1/PH) PWM_DRIVER1.16(PWM9) R38.2
TX0: FTDI.RXI MCU.47((TXD0/D1)PE1)
VBAT: BL_CONNECTOR.1 C1.A C2.A C3.A C4.1 C5.1 C6.1 C7.1 C8.1 C9.1 D2.K D3.K LED1.A SW1.S1 VREG-MCU.3(VIN) VREG-MCU.4(VIN) VREG-TEC.1(!SHDN) VREG-TEC.2(VIN) VREG-VIBE.1(VI)
VCC [vcc]: C10.1 C11.1 C12.1 C13.1 C23.1 C24.1 C25.1 C26.1 C27.1 C28.1 C50.1 C51.1 C52.1 C53.1 C54.1 C55.1 D4.K HBRIDGE-INDEX.7(NSLEEP) HBRIDGE-INDEX.8(VCC) HBRIDGE-MIDDLE.7(NSLEEP) HBRIDGE-MIDDLE.8(VCC) HBRIDGE-PINKY.7(NSLEEP) HBRIDGE-PINKY.8(VCC) HBRIDGE-RING.7(NSLEEP) HBRIDGE-RING.8(VCC) HBRIDGE-THUMB.7(NSLEEP) HBRIDGE-THUMB.8(VCC) L2.1 MCU.23(DEVDD) MCU.34(DEVDD) MCU.44(DEVDD) MCU.54(DEVDD) PWM_DRIVER1.28(VCC) R1.2 R2.2 R3.2 VREG-ANALOG.3(VI) VREG-MCU.5(VOUT) VREG-MCU.6(VOUT)
VIBE-INDEX: PWM_DRIVER1.9(PWM3) Q4.1(G) R35.2
VIBE-MIDDLE: PWM_DRIVER1.8(PWM2) Q3.1(G) R34.2
VIBE-PALM: PWM_DRIVER1.11(PWM5) Q6.1(G) R37.2
VIBE-PINKY: PWM_DRIVER1.6(PWM0) Q1.1(G) R32.2
VIBE-RING: PWM_DRIVER1.7(PWM1) Q2.1(G) R33.2
VIBE-THUMB: PWM_DRIVER1.10(PWM4) Q5.1(G) R36.2
VSENSOR: C38.1 C44.1 C45.1 C46.1 C47.1 C48.1 DEMUX1.24(VCC) FLEX-INDEX.1(+) FLEX-MIDDLE.1(+) FLEX-PINKY.1(+) FLEX-RING.1(+) FLEX-THUMB.1(+) JP1.2 OPAMP1.8(V+) OPAMP2.8(V+) OPAMP3.8(V+)
Unconnected: AVR_ISP.VCC FTDI.CTS FTDI.VCC J9.1 J9.2 MCU.1((ADC2/DIG2/A2*)PF2) MCU.2((ADC3/DIG4/A3*)PF3) MCU.3((ADC4/TCK/A4*)PF4) MCU.4((ADC5/TMS/A5*)PF5) MCU.5((ADC6/TDO/A6*)PF6) MCU.6((ADC7/TDI/A7*)PF7) MCU.13(RSTON) MCU.14((DIG3/D16)PG0) MCU.15((DIG1/D17)PG1) MCU.16((AMR/D18)PG2) MCU.17((TOSC2)PG3) MCU.18((TOSC1)PG4) MCU.19((OC0B/D19-PWM19)PG5) MCU.27((INT2/RXD1/D20)PD2) MCU.28((INT3/TXD1/D21)PD3) MCU.36((PCINT0/SSN/D10)PB0) MCU.40((PCINT4/OC2A/D9-PWM9)PB4) MCU.41((PCINT5/OC1A/D8-PWM8)PB5) MCU.48((XCK0/AIN0/D2)PE2) MCU.49((AIN1/OC3A/D3-PWM3)PE3) MCU.50((INT4/OC3B/D4-PWM4)PE4) MCU.51((INT5/OC3C/D5-PWM5)PE5) MCU.52((T3/INT6/D6)PE6) MCU.53((ICP3/INT7/CLKO/D7)PE7) MCU.64((ADC1/A1*)PF1) OPAMP3.5(IN-B+) OPAMP3.6(IN-B-) OPAMP3.7(OUT-B) SW1.S2 VREG-MCU.7(FB/NC) VREG-MCU.8(PG)

## Notes on the sheet
- TRANSMISSION OF TOUCH VR
- TOUCH GLOVE
- Rev 3
- Designed by: MrSwirlyEyes
- ACTUATORS | ATMEGA128RFA1 | SENSORS
- PWM DRIVER | ANALOG DEMUX
- NC
- PELTIER DRIVERS | VIBROTACTILES | FLEX SENSORS
- PROGRAMMER
- LEDS
- FTDI
- AVR ISP
- NC
- POWER SYSTEM
- MCU
- NC
- NC | NC | LPF
- VIBROTACTILES
- THERMOELECTRICS

## Library data of the parts
ANT = _radio_frequency:ANTENNA: Chip antenna Single endded antenna. Common with smaller chip antennas. CHIP4 package is the GPS Chip Antenna SKU: GPS-08418. CHIP5 package is 2.4GHz chip antenna SKU: WRL-00144.; DATASHEET: https://linxtechnologies.com/wp/wp-content/uploads/ant-fff-chp-x.pdf; DIST: Digikey; DISTLINK: https://www.digikey.com/products/en?keywords=ANT-2.45-CHPCT-ND; DISTPN: ANT-2.45-CHPCT-ND; MFR: Linx Technologies Inc.; MPN: ANT-2.45-CHP-T
AVR_ISP = _connectors:AVR_SPI_PRG_6: AVR ISP 6 Pin This is the reduced ISP connector for AVR programming. Common on Arduino. This footprint will take up less PCB space and can be used with a 10-pin to 6-pin adapter such as SKU: BOB-08508; DATASHEET: https://s3.amazonaws.com/catalogspreads-pdf/PAGE112-113%20.100%20MALE%20HDR.pdf; DIST: Digikey; DISTLINK: https://www.digikey.com/products/en?keywords=S2012E-03-ND; DISTPN: S2012E-03-ND; MFR: Sullins Connector Solutions; MPN: PEC03DAAN
BALUN1 = _radio_frequency:BALUN: 0805 footprint balun- Ember 351/357; DATASHEET: http://katalog.we-online.de/pbs/datasheet/748421245.pdf; DIST: Digikey; DISTLINK: https://www.digikey.com/products/en?keywords=732-2230-6-ND; DISTPN: 732-2230-6-ND; MFR: Wurth Electronics Inc.; MPN: 748421245
BL_CONNECTOR BR_CONNECTOR J9 TL_CONNECTOR = _connectors:1X02: 2 Positions Header Connector 0.079" (2.00mm) Through Hole Tin; DATASHEET: https://drawings-pdf.s3.amazonaws.com/C10436.pdf; DIST: Digikey; DISTLINK: https://www.digikey.com/products/en?keywords=S1012E-02-ND; DISTPN: S1012E-02-ND; MFR: Sullins Connector Solutions; MPN: PEC02SAAN
BR_ANALOG BR_NOISE = _power_symbols:NET_BRIDGE
C1-C3 C18 C21 = _capacitors:100UF-POLARIZED; DATASHEET: http://datasheets.avx.com/TLJ.pdf; DIST: Digikey; DISTLINK: https://www.digikey.com/products/en?keywords=478-5651-1-ND; DISTPN: 478-5651-1-ND; MFR: AVX Corporation; MPN: TLJA107M010R1400
C4 C6 C8 C11 C12 C15 = _capacitors:10UF; DATASHEET: https://www.murata.com/~/media/webrenewal/support/library/catalog/products/capacitor/mlcc/c02e.ashx; DIST: Digikey; DISTLINK: https://www.digikey.com/products/en?keywords=490-13233-1-ND; DISTPN: 490-13233-1-ND; MFR: Murata Electronics North America; MPN: GRM155C80J106ME11D
C5 C7 C9 C10 C13 C14 C22 C23 C25 C27 C30 C38 C44-C48 C50-C60 = _capacitors:0.1UF; DATASHEET: https://product.tdk.com/info/en/catalog/datasheets/mlcc_commercial_soft_en.pdf; DIST: Digikey; DISTLINK: https://www.digikey.com/products/en?keywords=445-173610-1-ND; DISTPN: 445-173610-1-ND; MFR: TDK Corporation; MPN: C1005X7R1H104K050BE
C24 C26 C28 C29 C31 C32 = _capacitors:1UF; DATASHEET: https://product.tdk.com/info/en/catalog/datasheets/mlcc_commercial_lowprofile_en.pdf; DIST: Digikey; DISTLINK: https://www.digikey.com/products/en?keywords=445-13185-1-ND; DISTPN: 445-13185-1-ND; MFR: TDK Corporation; MPN: CGB2A1X5R1E105K033BC
C33 C34 = _capacitors:12PF; DATASHEET: http://www.yuden.co.jp/productdata/catalog/mlcc06_e.pdf; DIST: Digikey; DISTLINK: https://www.digikey.com/products/en?keywords=587-5001-1-ND; DISTPN: 587-5001-1-ND; MFR: Taiyo Yuden; MPN: HMK105CG120JV-F
C35 = _capacitors:0.75PF; DATASHEET: https://product.tdk.com/info/en/documents/chara_sheet/C1005C0G1HR75C050BA.pdf; DIST: Digikey; DISTLINK: https://www.digikey.com/products/en?keywords=445-4853-1-ND; DISTPN: 445-4853-1-ND; MFR: TDK Corporation; MPN: C1005C0G1HR75C050BA
C36 = _capacitors:22PF; DATASHEET: http://www.vishay.com/docs/45071/vjhifreq.pdf; DIST: Digikey; DISTLINK: https://www.digikey.com/products/en?keywords=720-1286-1-ND; DISTPN: 720-1286-1-ND; MFR: Vishay Vitramon; MPN: VJ0402D220JXBAJ
D2 D3 = _discrete_semiconductors:GENERAL-PURPOSE; DATASHEET: http://www.comchiptech.com/cms/UserFiles/CGRKM4001-HF%20Thru.%20CGRKM4007-HF%20RevG.pdf; DIST: Digikey; DISTLINK: https://www.digikey.com/products/en?keywords=641-1511-1-ND; DISTPN: 641-1511-1-ND; MFR: Comchip Technology; MPN: CGRKM4001-HF
D4-D10 = _discrete_semiconductors:GENERAL-PURPOSE; DATASHEET: http://www.comchiptech.com/cms/UserFiles/CDSQR4148-HF-RevC213424.pdf; DIST: Digikey; DISTLINK: https://www.digikey.com/products/en?keywords=641-1677-1-ND; DISTPN: 641-1677-1-ND; MFR: Comchip Technology; MPN: CDSQR4148-HF
DEMUX1 = _special:CD74HC4067-SM96_16:1_MUX-DEMUX; DATASHEET: http://www.ti.com/lit/ds/symlink/cd74hc4067.pdf; DIST: Digikey; DISTLINK: https://www.digikey.com/products/en?keywords=296-9226-1-ND; DISTPN: 296-9226-1-ND; MFR: Texas Instruments; MPN: CD74HC4067SM96
FLEX-INDEX FLEX-MIDDLE FLEX-PINKY FLEX-RING FLEX-THUMB = _sensors:FLEX_SENSOR; DATASHEET: http://www.spectrasymbol.com/wp-content/uploads/2016/12/FLEX-SENSOR-DATA-SHEET-v2014-Rev-A.pdf; DATASHEET_CONNECTOR1: https://www.molex.com/pdm_docs/sd/530470210_sd.pdf; DATASHEET_CONNECTOR2: https://www.molex.com/pdm_docs/sd/510210700_sd.pdf; DATASHEET_CRIMP: https://www.molex.com/pdm_docs/sd/500798000_sd.pdf; DIST: Sparkfun; DISTLINK: https://www.sparkfun.com/products/8606; DISTLINK_CONNECTOR1: https://www.digikey.com/products/en?keywords=WM1731-ND; DISTLINK_CONNECTOR2: https://www.digikey.com/products/en?keywords=WM1720-ND; DISTLINK_CRIMP: https://www.digikey.com/products/en?keywords=WM1142CT-ND; DISTPN: SEN-08606; DISTPN_CONNECTOR1: WM1731-ND; DISTPN_CONNECTOR2: WM1720-ND; DISTPN_CRIMP: WM1142CT-ND; DIST_CONNECTOR1: Digikey; DIST_CONNECTOR2: Digikey; DIST_CRIMP: Digikey; MFR: Spectra Symbol; MFR_CONNECTOR1: Molex, LLC; MFR_CONNECTOR2: Molex, LLC; MFR_CRIMP: Molex, LLC; MPN: FS-L-0095-103-ST; MPN_CONNECTOR1: 0530470210; MPN_CONNECTOR2: 51021-0200; MPN_CRIMP: 0500798000
FTDI = _connectors:FTDI: FTDI Basic header with labels; DATASHEET: https://media.digikey.com/pdf/Data%20Sheets/Sparkfun%20PDFs/DEV-09873_Web.pdf; DATASHEET_CABLE: http://www.assmann-wsw.com/fileadmin/datasheets/ASS_7131_CA.pdf; DIST: Digikey; DISTLINK: https://www.digikey.com/products/en?keywords=1568-1104-ND; DISTLINK_CABLE: https://www.digikey.com/products/en?keywords=AE1450-ND; DISTLINK_CONNECTOR: https://www.digikey.com/products/en?keywords=S1112E-06-ND; DISTPN: 1568-1104-ND; DISTPN_CABLE: AE1450-ND; DISTPN_CONNECTOR: S1112E-06-ND; DIST_CABLE: Digikey; DIST_CONNECTOR: Digikey; MFR: SparkFun Electronics; MFR_CABLE: Assmann WSW Components; MFR_CONNECTOR: Sullins Connector Solutions; MPN: DEV-09873; MPN_CABLE: AK672M/2-1; MPN_CONNECTOR: PEC06SBAN; MPN_DATASHEET: https://s3.amazonaws.com/catalogspreads-pdf/PAGE112-113%20.100%20MALE%20HDR.pdf
HBRIDGE-INDEX HBRIDGE-MIDDLE HBRIDGE-PINKY HBRIDGE-RING HBRIDGE-THUMB = _special:DRV883X_H-BRIDGE: DRV883x Series H-Bridge - DRV8837 -> PWM (IN1 & IN2); DRV8838 -> PH IN1/ENA IN2; DATASHEET: http://www.ti.com/lit/ds/symlink/drv8837c.pdf; DIST: Digikey; DISTLINK: https://www.digikey.com/products/en?keywords=296-44747-1-ND; DISTPN: 296-44747-1-ND; MFR: Texas Instruments; MPN: DRV8837CDSGT
JP1 = _connectors:JUMPER_SMD_3-PAD_NO: Normally open jumper This jumper has three pads in close proximity to each other. Apply solder to close the connection(s).
L1 L2 = _inductors:10UH; DATASHEET: http://ds.yuden.co.jp/TYCOMPAS/ut/detail.do?productNo=CBMF1608T100K&fileName=CBMF1608T100K_SS&mode=specSheetDownload; DIST: Digikey; DISTLINK: https://www.digikey.com/products/en?keywords=587-1720-1-ND; DISTPN: 587-1720-1-ND; MFR: Taiyo Yuden; MPN: Taiyo Yuden
LED1 = _leds:LED; DATASHEET: https://www.bivar.com/portals/0/products/SM0402BWC.pdf; DIST: Digikey; DISTLINK: https://www.digikey.com/products/en?keywords=492-2203-1-ND; DISTPN: 492-2203-1-ND; MFR: Bivar Inc.; MPN: SM0402BWC
LED2 = _leds:LED; DATASHEET: https://www.bivar.com/portals/0/products/SM0402GC.pdf; DIST: Digikey; DISTLINK: https://www.digikey.com/products/en?keywords=492-2205-1-ND; DISTPN: 492-2205-1-ND; MFR: Bivar Inc.; MPN: SM0402GC
LED3 = _leds:LED; DATASHEET: https://www.bivar.com/portals/0/products/SM0402RC.pdf; DIST: Digikey; DISTLINK: https://www.digikey.com/products/en?keywords=492-2208-1-ND; DISTPN: 492-2208-1-ND; MFR: Bivar Inc.; MPN: SM0402RC
LIPO1 = _batteries:BATTERY-CONNECTOR_MOLEX; DATASHEET: https://www.molex.com/pdm_docs/sd/530470210_sd.pdf; DATASHEET_CONNECTOR: https://www.molex.com/pdm_docs/sd/510210700_sd.pdf; DATASHEET_CRIMP: https://www.molex.com/pdm_docs/sd/500798000_sd.pdf; DIST: Digikey; DISTLINK: https://www.digikey.com/products/en?keywords=WM1731-ND; DISTLINK_CONNECTOR: https://www.digikey.com/products/en?keywords=WM1720-ND; DISTLINK_CRIMP: https://www.digikey.com/products/en?keywords=WM1142CT-ND; DISTPN: WM1731-ND; DISTPN_CONNECTOR: WM1720-ND; DISTPN_CRIMP: WM1142CT-ND; DIST_CONNECTOR: Digikey; DIST_CRIMP: Digikey; MFR: Molex, LLC; MFR_CONNECTOR: Molex, LLC; MFR_CRIMP: Molex, LLC; MPN: 0530470210; MPN_CONNECTOR: 51021-0200; MPN_CRIMP: 0500798000
MCU = _ic_microcontrollers:ATMEGA128RFA1: ATmega128RFA1 8-bit AVR Microcontroller with Low Power 2.4GHz Transceiver for ZigBee and IEEE 802.15.4; DATASHEET: http://www.microchip.com/mymicrochip/filehandler.aspx?ddocname=en590262; DIST: Digikey; DISTLINK: https://www.digikey.com/products/en?keywords=ATMEGA128RFA1-ZU-ND; DISTPN: ATMEGA128RFA1-ZU-ND; MFR: Microchip Technology; MPN: ATMEGA128RFA1-ZU
OPAMP1-OPAMP3 = _op_amps:LM358; DATASHEET: http://www.st.com/content/ccc/resource/technical/document/datasheet/61/46/87/01/98/ed/44/c5/CD00000464.pdf/files/CD00000464.pdf/jcr:content/translations/en.CD00000464.pdf; DIST: Digikey; DISTLINK: https://www.digikey.com/products/en?keywords=497-12007-1-ND; DISTPN: 497-12007-1-ND; MFR: STMicroelectronics; MPN: LM358QT
PWM_DRIVER1 = _special:PCA9685_16-CH_12-BIT_PWM-DRIVER; DATASHEET: https://www.nxp.com/docs/en/data-sheet/PCA9685.pdf; DIST: Digikey; DISTLINK: https://www.digikey.com/products/en?keywords=568-11925-1-ND; DISTPN: 568-11925-1-ND; MFR: NXP USA Inc.; MPN: PCA9685PW,118
Q1-Q6 = _transistors:POWER_NCHAN: Collection of Power MOSFET; DATASHEET: https://media.digikey.com/pdf/Data%20Sheets/ON%20Semiconductor%20PDFs/MCH3474.pdf; DIST: Digikey; DISTLINK: https://www.digikey.com/products/en?keywords=MCH3474-TL-WOSCT; DISTPN: MCH3474-TL-WOSCT-ND; MFR: ON Semiconductor; MPN: MCH3474-TL-W
R1 R11-R15 R32-R48 = _resistors:10KΩ; DATASHEET: http://www.yageo.com/NewPortal/yageodocoutput?fileName=/pdf/R-Chip/PYu-RC_51_RoHS_P_0.pdf; DIST: Digikey; DISTLINK: https://www.digikey.com/products/en?keywords=YAG1281CT-ND; DISTPN: YAG1281CT-ND; MFR: Yageo; MPN: RC0402JR-0710KP
R2 R3 = _resistors:4.7KΩ; DATASHEET: http://www.samsungsem.com/kr/support/product-search/chip-resistor/RCS1005J472CS.jsp; DIST: Digikey; DISTLINK: https://www.digikey.com/products/en?keywords=1276-7028-1-ND; DISTPN: 1276-7028-1-ND; MFR: Samsung Electro-Mechanics; MPN: RCS1005J472CS
R4 R5 = _resistors:1KΩ; DATASHEET: http://www.yageo.com/documents/recent/PYu-RC_Group_51_RoHS_L_9.pdf; DIST: Digikey; DISTLINK: https://www.digikey.com/products/en?keywords=311-1.0KJRCT-ND; DISTPN: 311-1.0KJRCT-ND; MFR: Yageo; MPN: RC0402JR-071KL
SW1 = _switches:SWITCH_SPDT; DATASHEET: http://spec_sheets.e-switch.com/specs/T511006.pdf; DIST: Digikey; DISTLINK: https://www.digikey.com/products/en?keywords=EG2478-ND; DISTPN: EG2478-ND; MFR: E-Switch; MPN: 500SSP1S1M6QEA
TEC-INDEX TEC-MIDDLE TEC-PINKY TEC-RING TEC-THUMB = _actuators:PELTIER-TEC_CONNECTOR; DATASHEET: https://cdn2.hubspot.net/hubfs/547732/Data_Sheets/NL1025T.pdf; DATASHEET_CONNECTOR1: https://www.molex.com/pdm_docs/sd/530470210_sd.pdf; DATASHEET_CONNECTOR2: https://www.molex.com/pdm_docs/sd/510210700_sd.pdf; DATASHEET_CRIMP: https://www.molex.com/pdm_docs/sd/500798000_sd.pdf; DIST: Digikey; DISTLINK: https://www.digikey.com/products/en?keywords=1681-1032-ND; DISTLINK_CONNECTOR1: https://www.digikey.com/products/en?keywords=WM1731-ND; DISTLINK_CONNECTOR2: https://www.digikey.com/products/en?keywords=WM1720-ND; DISTLINK_CRIMP: https://www.digikey.com/products/en?keywords=WM1142CT-ND; DISTPN: 1681-1032-ND; DISTPN_CONNECTOR1: WM1731-ND; DISTPN_CONNECTOR2: WM1720-ND; DISTPN_CRIMP: WM1142CT-ND; DIST_CONNECTOR1: Digikey; DIST_CONNECTOR2: Digikey; DIST_CRIMP: Digikey; MFR: Marlow Industries, Inc.; MFR_CONNECTOR1: Molex, LLC; MFR_CONNECTOR2: Molex, LLC; MFR_CRIMP: Molex, LLC; MPN: NL1025T-01AC; MPN_CONNECTOR1: 0530470210; MPN_CONNECTOR2: 51021-0200; MPN_CRIMP: 0500798000
VIBE-INDEX VIBE-MIDDLE VIBE-PALM VIBE-PINKY VIBE-RING VIBE-THUMB = _actuators:VIBE-MOTOR_CONNECTOR; DATASHEET: http://www.vibration-motor.com/products/download/C0825B002F.pdf; DATASHEET_CONNECTOR1: https://www.molex.com/pdm_docs/sd/530470210_sd.pdf; DATASHEET_CONNECTOR2: https://www.molex.com/pdm_docs/sd/510210700_sd.pdf; DATASHEET_CRIMP: https://www.molex.com/pdm_docs/sd/500798000_sd.pdf; DIST: Digikey; DISTLINK: https://www.digikey.com/products/en?keywords=1670-1002-ND; DISTLINK_CONNECTOR1: https://www.digikey.com/products/en?keywords=WM1731-ND; DISTLINK_CONNECTOR2: https://www.digikey.com/products/en?keywords=WM1720-ND; DISTLINK_CRIMP: https://www.digikey.com/products/en?keywords=WM1142CT-ND; DISTPN: 1670-1002-ND; DISTPN_CONNECTOR1: WM1731-ND; DISTPN_CONNECTOR2: WM1720-ND; DISTPN_CRIMP: WM1142CT-ND; DIST_CONNECTOR1: Digikey; DIST_CONNECTOR2: Digikey; DIST_CRIMP: Digikey; MFR: Jinlong Machinery & Electronics, Inc.; MFR_CONNECTOR1: Molex, LLC; MFR_CONNECTOR2: Molex, LLC; MFR_CRIMP: Molex, LLC; MPN: C0825B002F; MPN_CONNECTOR1: 0530470210; MPN_CONNECTOR2: 51021-0200; MPN_CRIMP: 0500798000
VREG-ANALOG = _ic_power:VREG_LINEAR_MCP1700: MCP1700 Voltage Regulator Series; DATASHEET: http://ww1.microchip.com/downloads/en/DeviceDoc/20001826D.pdf; DIST: Digikey; DISTLINK: https://www.digikey.com/products/en?keywords=MCP1700T1802ETTCT-ND; DISTPN: MCP1700T1802ETTCT-ND; MFR: Microchip Technology; MPN: MCP1700T-1802E/TT
VREG-MCU = _ic_power:VREG_TPS768XX_ULDO_FAST-TRANSIENT; DATASHEET: http://www.ti.com/lit/ds/symlink/tps768.pdf; DIST: Digikey; DISTLINK: https://www.digikey.com/products/en?keywords=296-46395-1-ND; DISTPN: 296-46395-1-ND; MFR: Texas Instruments; MPN: TPS76833QDR
VREG-TEC = _ic_power:VREG_LT1764EQ_ULDO_FAST-TRANSIENT; DATASHEET: http://www.analog.com/media/en/technical-documentation/data-sheets/1764fb.pdf?domain=www.linear.com; DIST: Digikey; DISTLINK: https://www.digikey.com/products/en?keywords=LT1764EQ-1.8%23PBF-ND; DISTPN: LT1764EQ-1.8#PBF-ND; MFR: Linear Technology/Analog Devices; MPN: LT1764EQ-1.8#PBF
VREG-VIBE = _ic_power:VREG_TL1963A-XX_1.5A_LN_LDO_FAST-TRANSIENT; DATASHEET: TL1963A-xx DatasheetTL1963A-xx; DIST: Digikey; DISTLINK: https://www.digikey.com/products/en?keywords=296-24897-1-ND; DISTPN: 296-24897-1-ND; MFR: Texas Instruments; MPN: TL1963A-33DCYR
XTAL = _crystals_oscillators_resonators:CRYSTAL: Various standard crystals. Proven footprints.; DATASHEET: https://abracon.com/Resonators/abm3b.pdf; DIST: Digikey; DISTLINK: https://www.digikey.com/products/en?keywords=535-9122-1-ND; DISTPN: 535-9122-1-ND; MFR: Abracon LLC; MPN: ABM3B-16.000MHZ-B2-T

## Net classes
1 vcc: width 0.254 mm, drill 0.254 mm, clearance 0.127 mm
2 RFSIG: width 0.406 mm
3 ASIG: width 0.254 mm
4 DGND: width 0.254 mm
5 NGND: width 0.254 mm